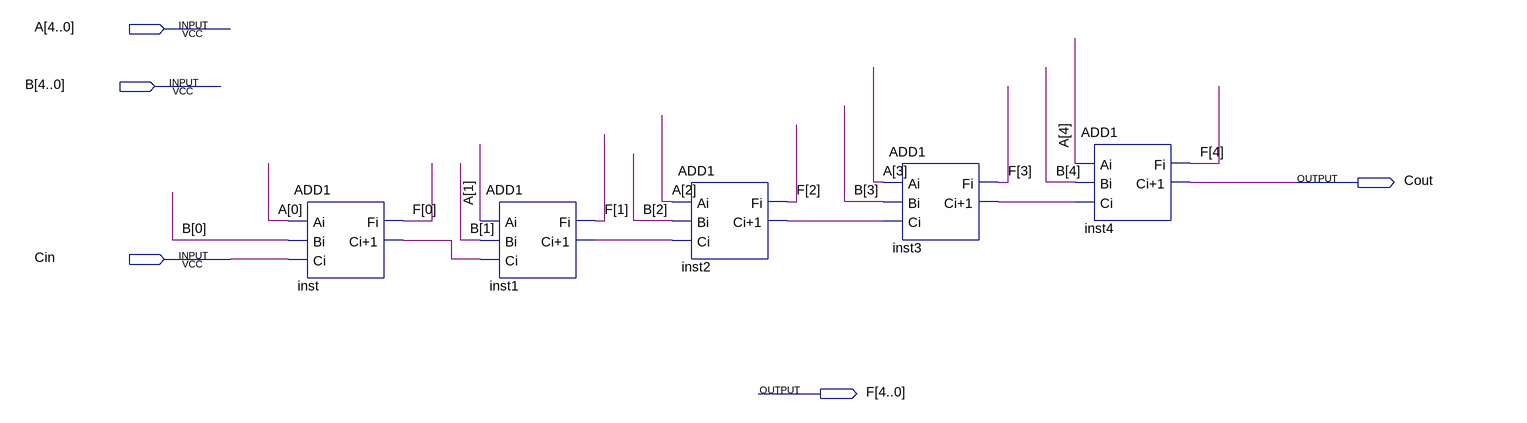
[diagram p0: schematic sheet]
// Quartus schematic ADD5.bdf as structural Verilog: 5 symbols, 5 pins
module ADD5 (
  input  [4:0] A,
  input  [4:0] B,
  input  Cin,
  output Cout,
  output [4:0] F
);

  wire inst1_ci_1, inst2_ci_1, inst3_ci_1, inst_ci_1;

  ADD1 inst (.Ai(A[0]), .Bi(B[0]), .Ci(Cin), .Fi(F[0]), .\Ci+1 (inst_ci_1));
  ADD1 inst1 (.Ai(A[1]), .Bi(B[1]), .Ci(inst_ci_1), .Fi(F[1]), .\Ci+1 (inst1_ci_1));
  ADD1 inst2 (.Ai(A[2]), .Bi(B[2]), .Ci(inst1_ci_1), .Fi(F[2]), .\Ci+1 (inst2_ci_1));
  ADD1 inst3 (.Ai(A[3]), .Bi(B[3]), .Ci(inst2_ci_1), .Fi(F[3]), .\Ci+1 (inst3_ci_1));
  ADD1 inst4 (.Ai(A[4]), .Bi(B[4]), .Ci(inst3_ci_1), .Fi(F[4]), .\Ci+1 (Cout));
endmodule
